# EAGLE design Relevadores (EAGLE 6.2)
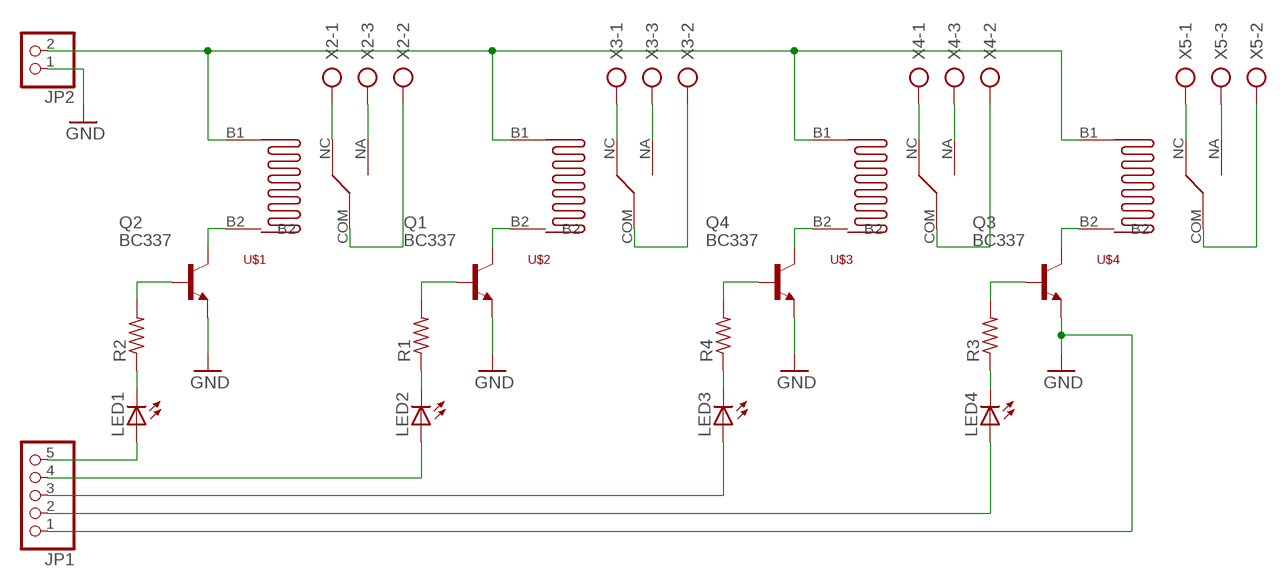
[diagram p0: schematic, sheet 1]

## Parts
JP1  PINHD-1X5/90  [1X05/90]
JP2  PINHD-1X2/90  [1X02/90]
LED1  LED3MM  [LED3MM]
LED2  LED3MM  [LED3MM]
LED3  LED3MM  [LED3MM]
LED4  LED3MM  [LED3MM]
Q1  BC337  [TO92]
Q2  BC337  [TO92]
Q3  BC337  [TO92]
Q4  BC337  [TO92]
R1  R-US_0207/2V  [0207/2V]
R2  R-US_0207/2V  [0207/2V]
R3  R-US_0207/2V  [0207/2V]
R4  R-US_0207/2V  [0207/2V]
U$1  RAS-0510  [RAS-0510]
U$2  RAS-0510  [RAS-0510]
U$3  RAS-0510  [RAS-0510]
U$4  RAS-0510  [RAS-0510]
X2  AK300/3  [AK300/3]
X3  AK300/3  [AK300/3]
X4  AK300/3  [AK300/3]
X5  AK300/3  [AK300/3]

## Nets
GND: JP1.1 JP2.1 Q1.1(E) Q2.1(E) Q3.1(E) Q4.1(E)
N$1: Q1.3(C) U$2.B2
N$2: Q1.2(B) R1.2
N$3: JP2.2 U$1.B1 U$2.B1 U$3.B1 U$4.B1
N$4: Q4.3(C) U$3.B2
N$5: Q4.2(B) R4.2
N$6: Q2.3(C) U$1.B2
N$7: Q2.2(B) R2.2
N$8: Q3.3(C) U$4.B2
N$9: Q3.2(B) R3.2
N$10: U$1.NC X2.1
N$11: U$1.NA X2.3
N$12: U$1.COM X2.2
N$13: U$2.NC X3.1
N$14: U$2.NA X3.3
N$15: U$2.COM X3.2
N$16: U$3.NC X4.1
N$17: U$3.NA X4.3
N$18: U$3.COM X4.2
N$19: U$4.NC X5.1
N$20: U$4.NA X5.3
N$21: U$4.COM X5.2
N$22: LED2.K(C) R1.1
N$23: JP1.5 LED1.A
N$24: JP1.4 LED2.A
N$25: JP1.3 LED3.A
N$26: JP1.2 LED4.A
N$27: LED3.K(C) R4.1
N$28: LED4.K(C) R3.1
N$29: LED1.K(C) R2.1

## Library data of the parts
JP1 = pinhead:PINHD-1X5: PIN HEADER
JP2 = pinhead:PINHD-1X2: PIN HEADER
LED1-LED4 = led:LED: LED OSRAM: - CHIPLED LG R971, LG N971, LY N971, LG Q971, LY Q971, LO R971, LY R971 LH N974, LH R974 LS Q976, LO Q976, LY Q976 LO Q996 - Hyper CHIPLED LW Q18S LB Q993, LB Q99A, LB R99A - SideLED LS A670, LO A670, LY A670, LG A670, LP A670 LB A673, LV A673, LT A673, LW A673 LH A674 LY A675 LS A676, LA A676, LO A676, LY A676, LW A676 LS A679, LY A679, LG A679 - Hyper Micro SIDELED® LS Y876, LA Y876, LO Y876, LY Y876 LT Y87S - SmartLED LW L88C, LW L88S LB L89C, LB L89S, LG L890 LS L89K, LO L89K, LY L89K LS L896, LA L896, LO L896, LY L896 - TOPLED LS T670, LO T670, LY T670, LG T670, LP T670 LSG T670, LSP T670, LSY T670, LOP T670, LYG T670 LG T671, LOG T671, LSG T671 LB T673, LV T673, LT T673, LW T673 LH T674 LS T676, LA T676, LO T676, LY T676, LB T676, LH T676, LSB T676, LW T676 LB T67C, LV T67C, LT T67C, LS T67K, LO T67K, LY T67K, LW E67C LS E67B, LA E67B, LO E67B, LY E67B, LB E67C, LV E67C, LT E67C LW T67C LS T679, LY T679, LG T679 LS T770, LO T770, LY T770, LG T770, LP T770 LB T773, LV T773, LT T773, LW T773 LH T774 LS E675, LA E675, LY E675, LS T675 LS T776, LA T776, LO T776, LY T776, LB T776 LHGB T686 LT T68C, LB T68C - Hyper Mini TOPLED® LB M676 - Mini TOPLED Santana® LG M470 LS M47K, LO M47K, LY M47K Source: http://www.osram.convergy.de LUXEON: - LUMILED® LXK2-PW12-R00, LXK2-PW12-S00, LXK2-PW14-U00, LXK2-PW14-V00 LXK2-PM12-R00, LXK2-PM12-S00, LXK2-PM14-U00 LXK2-PE12-Q00, LXK2-PE12-R00, LXK2-PE12-S00, LXK2-PE14-T00, LXK2-PE14-U00 LXK2-PB12-K00, LXK2-PB12-L00, LXK2-PB12-M00, LXK2-PB14-N00, LXK2-PB14-P00, LXK2-PB14-Q00 LXK2-PR12-L00, LXK2-PR12-M00, LXK2-PR14-Q00, LXK2-PR14-R00 LXK2-PD12-Q00, LXK2-PD12-R00, LXK2-PD12-S00 LXK2-PH12-R00, LXK2-PH12-S00 LXK2-PL12-P00, LXK2-PL12-Q00, LXK2-PL12-R00 Source: www.luxeon.com KINGBRIGHT: KA-3528ASYC Source: www.kingbright.com
Q1-Q4 = transistor-npn:BC337*: NPN Transistor
R1-R4 = resistor:R-US_: RESISTOR, American symbol
U$1-U$4 = CustumLib:RAS-0510
X2-X5 = con-ptr500:AK300/3: CONNECTOR; OC_FARNELL: unknown; OC_NEWARK: unknown

## Board
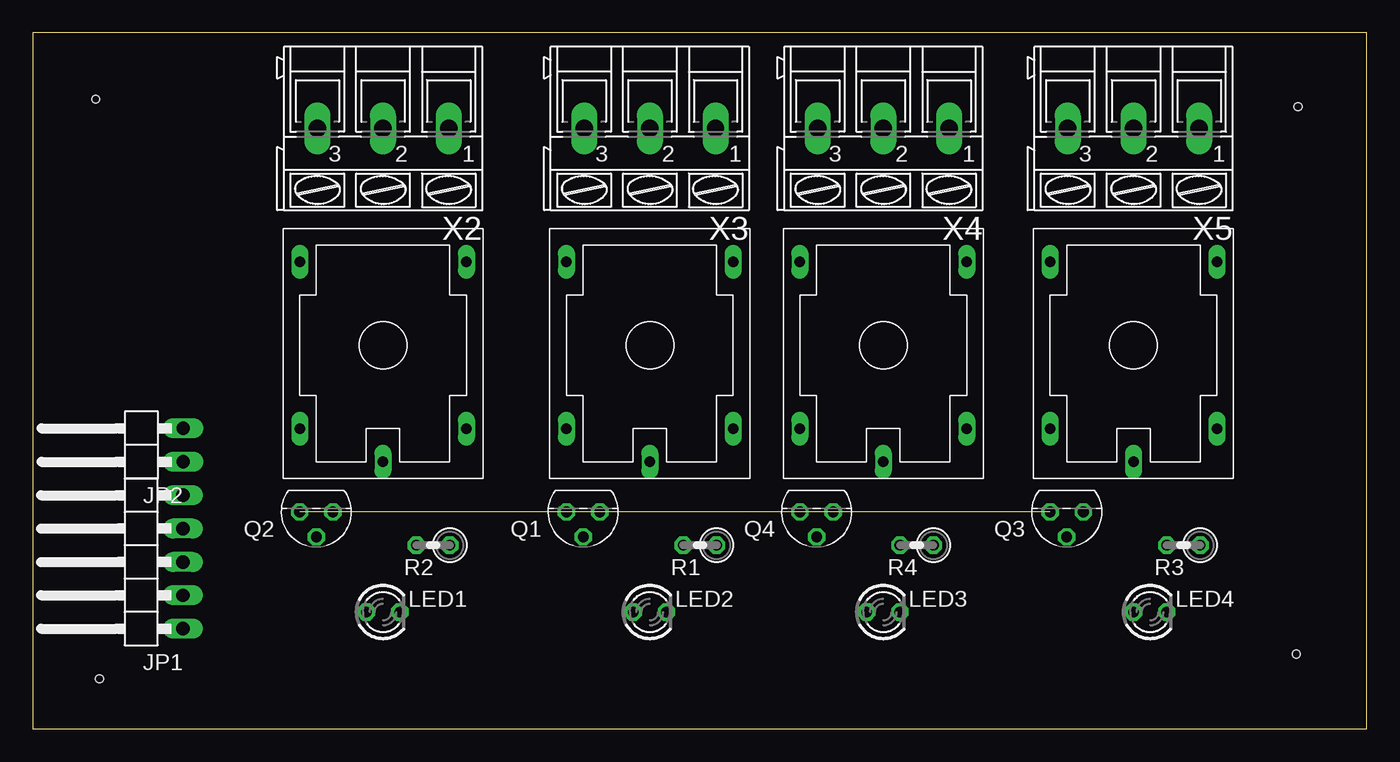
[diagram p1: board, top side]
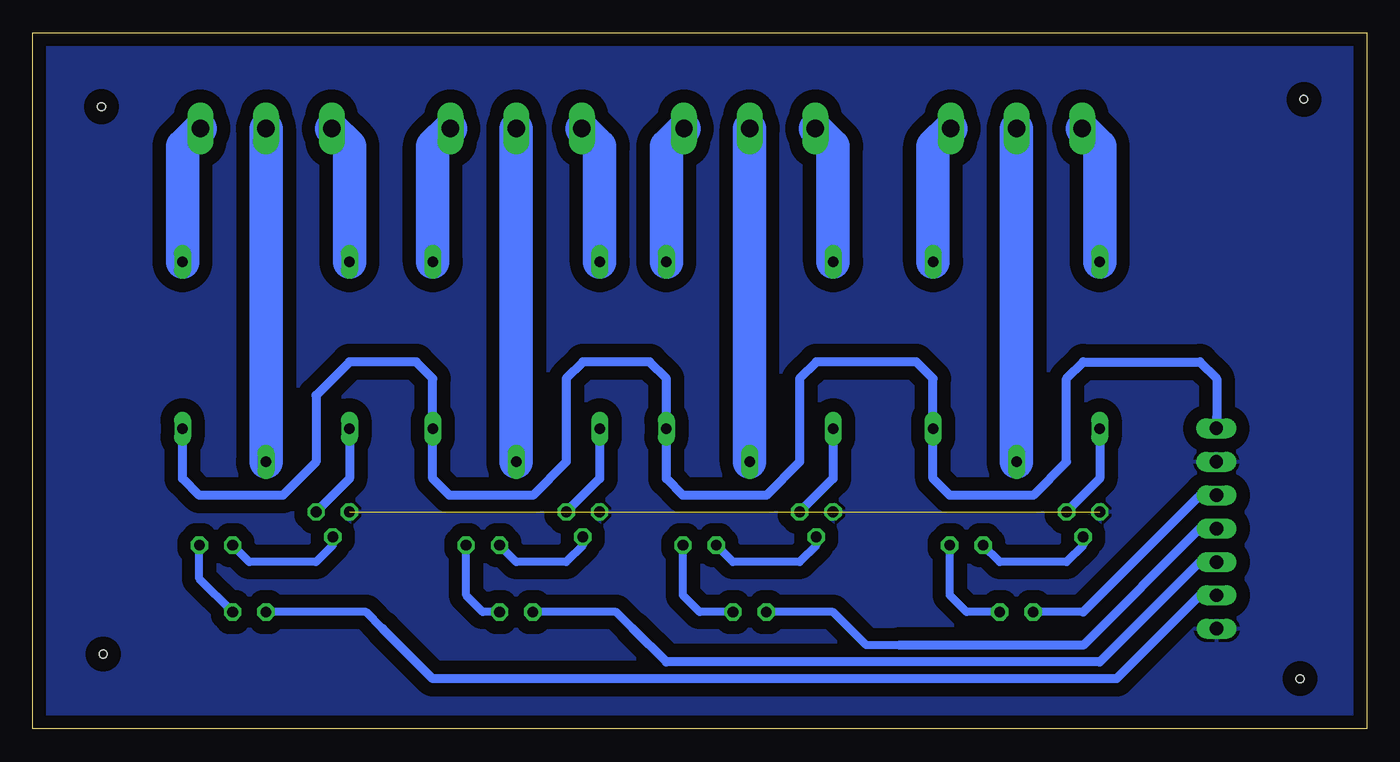
[diagram p2: board, bottom side, seen from below]

Size 101.58 x 53.01 mm. Coordinates in mm from the lower left corner, seen from the top.
Outline: 0,0 101.58,0 101.58,53.01 0,53.01 0,0
Copper layers (1*16): Top 0.035mm / dielectric 1.5mm / Bottom 0.035mm
Design rules: minimum track width 10mil, minimum drill 24mil, track to track 8mil, track to pad 8mil, pad to pad 8mil, via to via 8mil, smd to smd 8mil, copper to edge 40mil, drill to drill 8mil, minimum pad ring 10mil, minimum via ring 8mil, stop-mask expansion 4mil, vias tented up to drill 0mil, thermal gap 10mil
Holes 0.6 mm at 4.78,47.94 96.22,5.68 96.36,47.38 5.08,3.81

### Footprints (pad centres in the part's own frame; a part is rotated, then mirrored left to right if it is on the bottom)
1X05/90 = drill 1.016 long: 1 -5.08,-3.81; 2 -2.54,-3.81; 3 0,-3.81; 4 2.54,-3.81; 5 5.08,-3.81
1X02/90 = drill 1.016 long: 1 -1.27,-3.81; 2 1.27,-3.81
LED3MM = drill 0.813 octagon: A -1.27,0; K 1.27,0
TO92 = drill 0.813 octagon: 1 1.27,0; 2 0,1.905; 3 -1.27,0
0207/2V = drill 0.813 octagon: 1 -1.27,0; 2 1.27,0
RAS-0510 = drill 0.8 long: B1 -6.35,6.35; B2 6.35,6.35; COM 0,8.89; NA 6.35,-6.35; NC -6.35,-6.35
AK300/3 = drill 1.321 long: 1 -5.004,0; 2 0,0; 3 5.004,0

### Placement (x,y rotation side)
JP1  7.62,12.7 90 top
JP2  7.64,21.61 90 top
LED1  26.67,8.89 0 top
LED2  46.99,8.89 0 top
LED3  64.77,8.89 0 top
LED4  85.09,8.89 0 top
Q1  41.91,16.51 180 top
Q2  21.59,16.51 180 top
Q3  78.74,16.51 180 top
Q4  59.69,16.51 180 top
R1  50.8,13.97 180 top
R2  30.48,13.97 180 top
R3  87.63,13.97 180 top
R4  67.31,13.97 180 top
U$1  26.67,29.21 180 top
U$2  46.99,29.21 180 top
U$3  64.77,29.21 180 top
U$4  83.82,29.21 180 top
X2  26.67,45.72 180 top
X3  46.99,45.72 180 top
X4  64.77,45.72 180 top
X5  83.82,45.72 180 top

### Tracks (layer width: path | path; a pad name or v marks a point on that pad's centre or on a via)
GND  (3 unrouted)
  pour Bottom (isolate 1.016): 0,0 0,53.34 101.6,53.34 101.6,0
N$1
  Bottom 0.7: U$2.B2 40.64,19.05 Q1.3
N$2
  Bottom 0.61: Q1.2 41.91,13.97 43.18,12.7 48.26,12.7 R1.2
N$3
  Bottom 0.7: U$4.B1 90.17,19.05 88.9,17.78 82.55,17.78 80.01,20.32 80.01,25.4 77.47,27.94 72.39,27.94 71.12,26.67 U$3.B1 71.12,19.05 69.85,17.78 63.5,17.78 60.96,20.32 60.96,26.67 59.69,27.94 54.61,27.94 53.34,26.67 U$2.B1 53.34,19.05 52.07,17.78 45.72,17.78 43.18,20.32 43.18,26.67 41.91,27.94 34.29,27.94 33.02,26.67 U$1.B1 33.02,19.05 31.75,17.78 25.4,17.78 22.86,20.32 22.86,26.67 21.59,27.94 12.7,27.94 11.43,26.67 11.43,22.9 JP2.2 11.43,23.71
N$4
  Bottom 0.7: U$3.B2 58.42,19.05 Q4.3
N$5
  Bottom 0.61: Q4.2 59.69,13.97 60.96,12.7 64.77,12.7 R4.2
N$6
  Bottom 0.7: U$1.B2 20.32,19.05 Q2.3
N$7
  Bottom 0.61: Q2.2 21.59,13.97 22.86,12.7 27.94,12.7 R2.2
N$8
  Bottom 0.7: U$4.B2 77.47,19.05 Q3.3
N$9
  Bottom 0.61: Q3.2 78.74,13.97 80.01,12.7 85.09,12.7 R3.2
N$10
  Bottom 2.54: U$1.NC 33.02,44.37 X2.1
N$11
  Bottom 2.54: U$1.NA 20.32,44.37 X2.3
N$12
  Bottom 2.54: X2.2 U$1.COM
N$13
  Bottom 2.54: U$2.NC 53.34,44.37 X3.1
N$14
  Bottom 2.54: U$2.NA 40.64,44.37 X3.3
N$15
  Bottom 2.54: U$2.COM X3.2
N$16
  Bottom 2.54: U$3.NC 71.12,44.37 X4.1
N$17
  Bottom 2.54: U$3.NA 58.42,44.37 X4.3
N$18
  Bottom 2.54: X4.2 U$3.COM
N$19
  Bottom 2.54: U$4.NC 90.17,44.37 X5.1
N$20
  Bottom 2.54: U$4.NA 77.47,44.37 X5.3
N$21
  Bottom 2.54: X5.2 U$4.COM
N$22
  Bottom 0.61: LED2.K 50.8,8.89 52.07,10.16 R1.1
N$23
  Bottom 0.61: 21.59,8.89 LED1.A
  Bottom 0.7: JP1.5 12.7,17.78 21.59,8.89
N$24
  Bottom 0.61: 35.56,6.35 38.1,6.35 40.64,8.89 LED2.A
  Bottom 0.7: JP1.4 12.7,15.24 21.59,6.35 35.56,6.35
N$25
  Bottom 0.61: 55.88,7.62 57.15,8.89 LED3.A
  Bottom 0.7: JP1.3 12.7,12.7 20.32,5.08 53.34,5.08 55.88,7.62
N$26
  Bottom 0.61: 74.93,7.62 76.2,8.89 LED4.A
  Bottom 0.7: JP1.2 12.7,10.16 19.05,3.81 71.12,3.81 74.93,7.62
N$27
  Bottom 0.61: LED3.K 67.31,8.89 68.58,10.16 R4.1
N$28
  Bottom 0.61: LED4.K 88.9,11.43 R3.1
N$29
  Bottom 0.61: LED1.K 30.48,8.89 31.75,10.16 R2.1

### Text on the board
Custom: NC | NO | Rev.2 | Relay Module | VDD | VSS | RL1 | RL1 | RL2 | RL3 | RL4 | RL2 | RL3 | BC337 | BC337 | BC337 | BC337 | RL4 | GND | 1K | 1K | 1K | 1K